# EasyEDA Pro project Drone.eprj, board PCB1
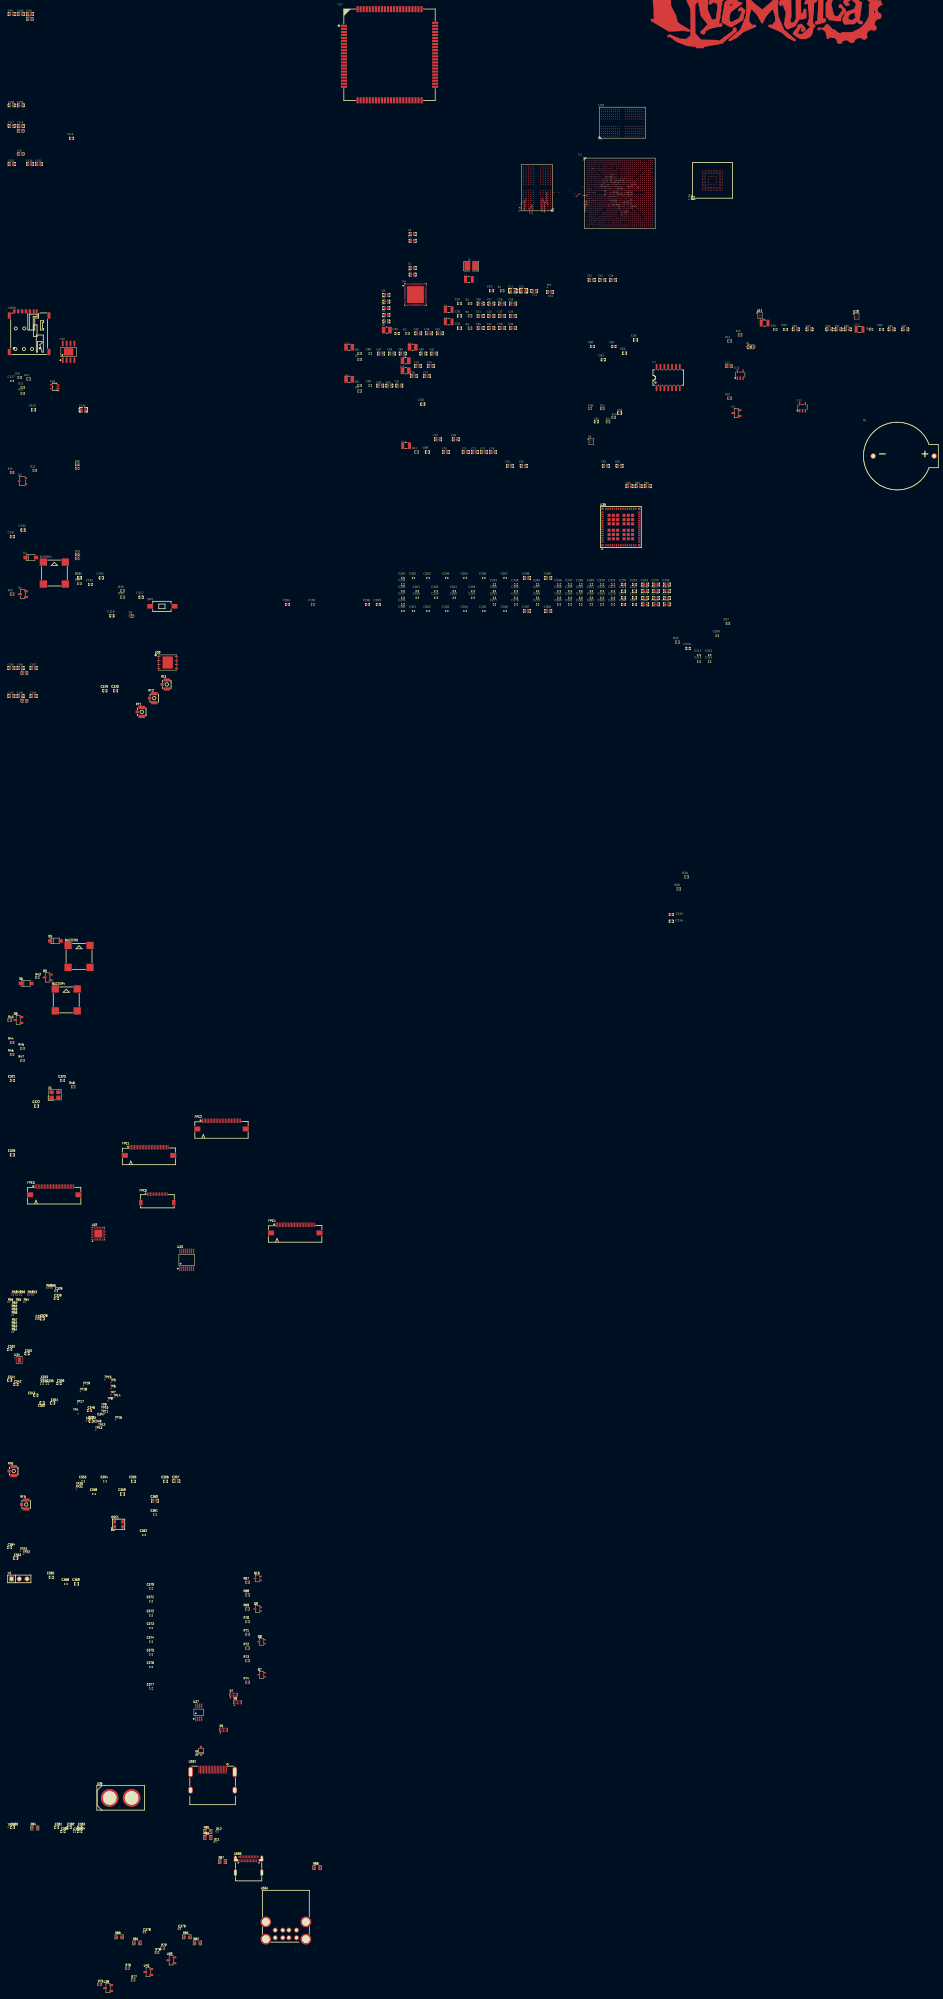
[diagram p9: board, top side]
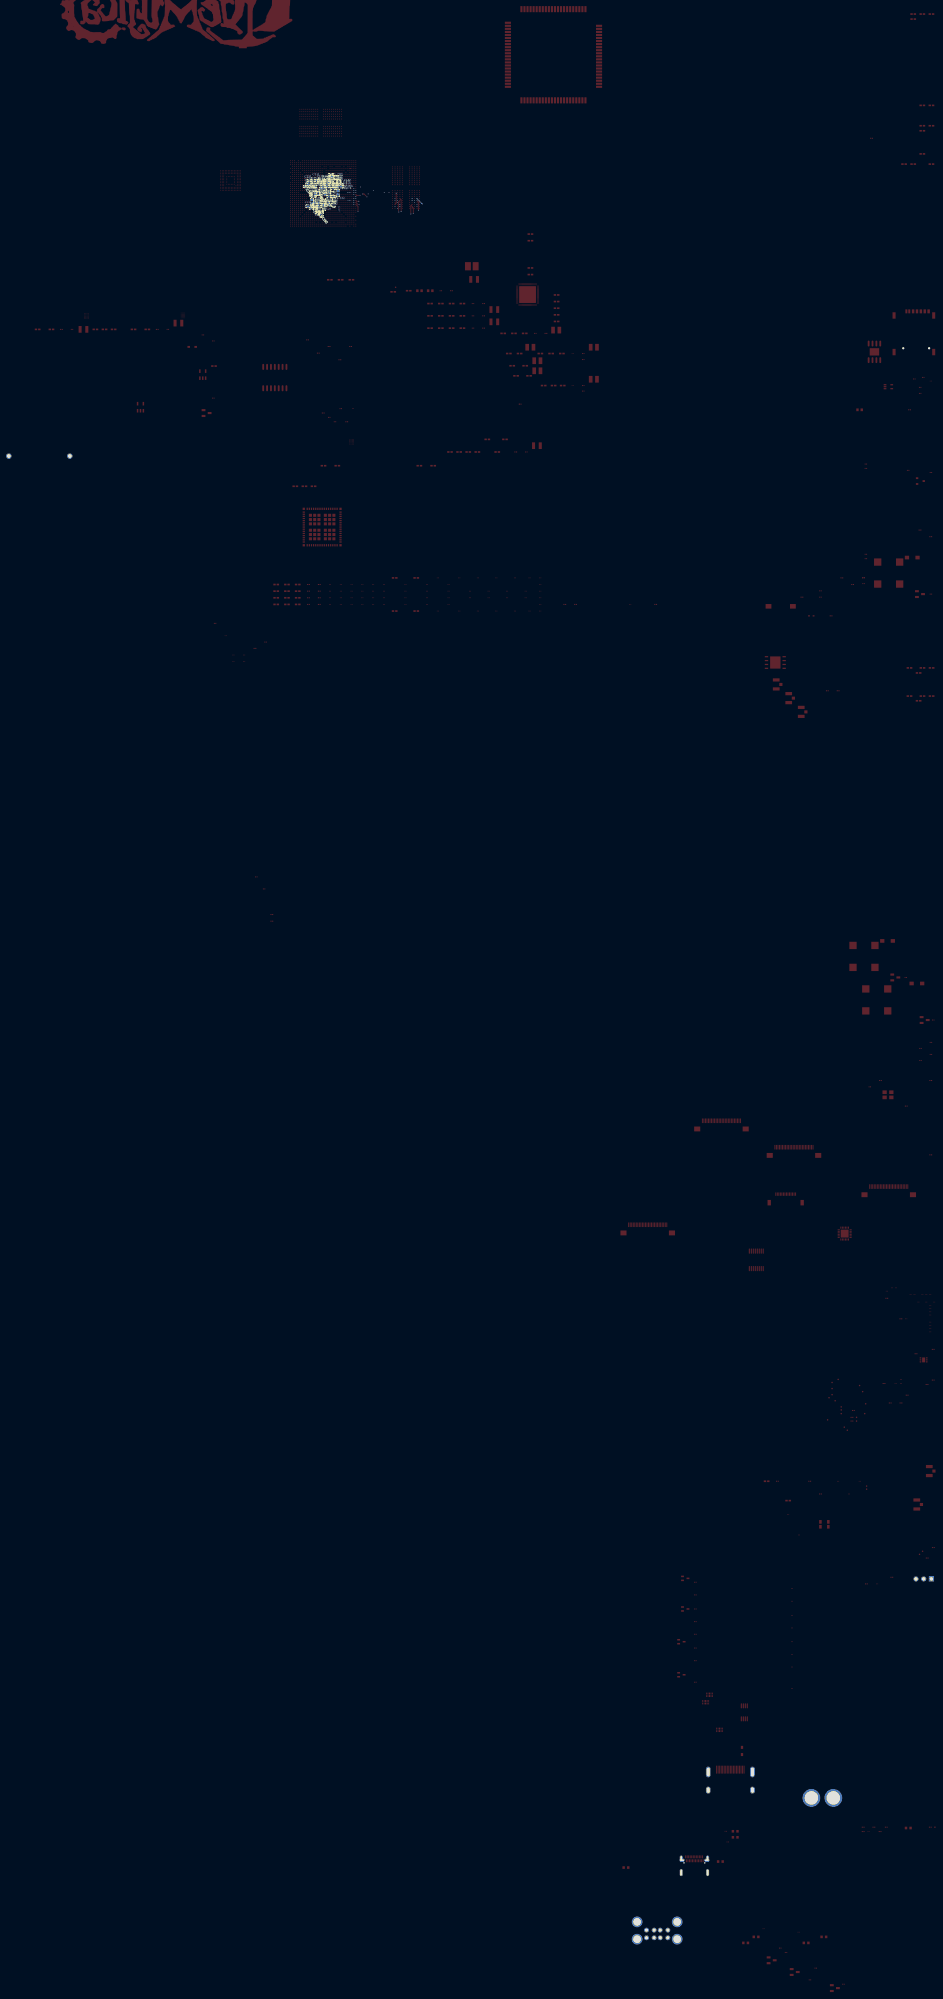
[diagram p10: board, bottom side, seen from below]

Outline 81.01 x 497.2 mm; copper layers: Top Layer, GND1, Inner2, VCC1, VCC2, Inner5, GND2, Bottom Layer. Coordinates in mm from the lower left corner of the outline.
Stack: Top Layer 0.035mm 外层铜厚1oz / Dielectric1 0.1164mm 2116 RC54% 4.9mil / GND1 0.0152mm 内层铜厚 / Dielectric2 0.3mm 0.3mm H/HOZ No copper / Inner2 0.0152mm 内层铜厚 / Dielectric3 0.0764mm 1080 RC67% 3.3mil / Dielectric4 0.0764mm 1080 RC67% 3.3mil / VCC1 0.0152mm 内层铜厚 / Dielectric5 0.3mm 0.3mm H/HOZ No copper / VCC2 0.0152mm 内层铜厚 / Dielectric6 0.0764mm 1080 RC67% 3.3mil / Dielectric7 0.0764mm 1080 RC67% 3.3mil / Inner5 0.0152mm 内层铜厚 / Dielectric8 0.3mm 0.3mm H/HOZ No copper / GND2 0.0152mm 内层铜厚 / Dielectric9 0.1164mm 2116 RC54% 4.9mil / Bottom Layer 0.035mm 外层铜厚1oz

## Design rules (mm)
net CH0_DQ0_A: DDR_CH0_BIT1
net CH0_DQ7_A: DDR_CH0_BIT1
net CH0_DQ1_A: DDR_CH0_BIT1
net CH0_DQ6_A: DDR_CH0_BIT1
net CH0_DQS0P_A: DDR_CH0_BIT1, DQS0_A
net CH0_DQS1P_A: DQS1_A
net CH0_DQ2_A: DDR_CH0_BIT1
net CH0_DQS0N_A: DDR_CH0_BIT1, DQS0_A
net CH0_DQ5_A: DDR_CH0_BIT1
net CH0_DQS1N_A: DQS1_A
net CH0_DQ3_A: DDR_CH0_BIT1
net CH0_DQ4_A: DDR_CH0_BIT1
net CH0_DQS0N_B: DQS0_B
net CH0_DQS1N_B: DQS1_B
net CH0_DQS0P_B: DQS0_B
net CH0_DQS1P_B: DQS1_B
net CH1_DQS0P_C: DQS0_C
net CH1_DQS1P_C: DQS1_C
net CH1_DQS0N_C: DQS0_C
net CH1_DQS1N_C: DQS1_C
net CH1_DQS0N_D: DQS0_D
net CH1_DQS1N_D: DQS1_D
net CH1_DQS0P_D: DQS0_D
net CH1_DQS1P_D: DQS1_D
template: 自定义配置
spacing copperThickness1oz (default): track to track 0.089, other pairs 0 to 0.203
spacing copperThickness2oz: track to track 0.203, other pairs 0.152 to 0.3
track width copperThickness1oz (default): min 0.102, default 0.254, max 2.54
track width copperThickness2oz: min 0.102, default 0.254, max 2.54
differential pair differentialPair (default): width min 0.102, default 0.254, max 2.54; gap min 0.152, default 0.152
via viaSize (default): diameter min 0.305, default 0.305, max 10; hole min 0.102, default 0.203, max 6.299

## Placement (name value [footprint] x y rotation side)
B1  BS-02-A1AJ010  [BAT-TH_BS-02-A1AJ010]  292.25 461.48 0 top
BUZZER1  2.7kHz  [BUZ-SMD_4P-L8.5-W8.5-P8.50-BR]  13.64 423.12 0 top
BUZZER3  2.7kHz  [BUZ-SMD_4P-L8.5-W8.5-P8.50-BR]  21.75 297.43 0 top
BUZZER4  2.7kHz  [BUZ-SMD_4P-L8.5-W8.5-P8.50-BR]  17.55 283.17 0 top
C1  10uF  [C0402]  131.17 520.98 0 top
C2  10uF  [C0402]  131.17 523.16 0 top
C3  22uF  [C0402]  131.17 532.08 0 top
C4  22uF  [C0402]  131.17 534.26 0 top
C5  22uF  [C0402]  122.57 505.61 0 top
C6  10uF  [C0402]  122.57 507.78 0 top
C7  22uF  [C0402]  122.57 509.96 0 top
C8  10uF  [C0402]  122.57 512.13 0 top
C9  22uF  [C0402]  122.57 514.31 0 top
C10  1uF  [C0201]  157.06 515.68 0 top
C11  47uF  [C0603]  164.02 515.68 0 top
C12  47uF  [C0603]  167.55 515.68 0 top
C13  22uF  [C0402]  171.08 515.68 0 top
C14  22uF  [C0402]  176.17 515.33 0 top
C15  100nF  [C01005]  199.16 545.3 180 bottom
C16  100nF  [C01005]  199.16 544.67 180 bottom
C17  1uF  [C0201]  195.6 543.78 90 bottom
C18  1uF  [C0201]  195.6 545.55 270 bottom
C19  4.7uF  [C0201]  197.76 544.67 180 bottom
C20  10uF  [C0402]  197.51 543.9 180 bottom
C21  10uF  [C0402]  197.25 545.3 180 bottom
C22  22uF  [C0402]  189.88 519.27 0 top
C23  22uF  [C0402]  193.41 519.27 0 top
C24  22uF  [C0402]  196.95 519.27 0 top
C25  1uF  [C0201]  146.52 511.47 0 top
C26  22uF  [C0402]  153.47 511.47 0 top
C27  22uF  [C0402]  157.01 511.47 0 top
C28  22uF  [C0402]  160.54 511.47 0 top
C29  22uF  [C0402]  164.08 511.47 0 top
C30  1uF  [C0201]  146.52 507.45 0 top
C31  22uF  [C0402]  153.47 507.45 0 top
C32  22uF  [C0402]  157.01 507.45 0 top
C33  22uF  [C0402]  160.54 507.45 0 top
C34  22uF  [C0402]  164.08 507.45 0 top
C35  1uF  [C0201]  146.52 503.42 0 top
C36  22uF  [C0402]  153.47 503.42 0 top
C37  22uF  [C0402]  157.01 503.42 0 top
C38  22uF  [C0402]  160.54 503.42 0 top
C39  22uF  [C0402]  164.08 503.42 0 top
C40  22uF  [C0402]  134.71 495.09 0 top
C41  22uF  [C0402]  138.24 495.09 0 top
C42  1uF  [C0201]  126.07 501.7 0 top
C43  22uF  [C0402]  133.03 501.7 0 top
C44  22uF  [C0402]  136.56 501.7 0 top
C45  10uF  [C0402]  140.1 501.7 0 top
C46  100pF  [C01005]  117.3 495.09 0 top
C47  22uF  [C0402]  120.84 495.09 0 top
C48  22uF  [C0402]  124.37 495.09 0 top
C49  10uF  [C0402]  127.9 495.09 0 top
C50  100pF  [C01005]  117.3 484.59 0 top
C51  10uF  [C0402]  126.82 484.59 0 top
C52  22uF  [C0402]  120.56 484.59 0 top
C53  22uF  [C0402]  123.55 484.59 0 top
C54  22uF  [C0402]  132.88 491.08 0 top
C55  22uF  [C0402]  137.14 491.08 0 top
C56  22uF  [C0402]  131.61 487.78 0 top
C57  22uF  [C0402]  135.87 487.78 0 top
C58  1uF  [C0201]  134.53 478.5 0 top
C59  1uF  [C0201]  204.27 499.57 0 top
C60  1uF  [C0201]  190.13 497.4 0 top
C61  1uF  [C0201]  197.2 497.4 0 top
C62  1uF  [C0201]  200.74 495.22 0 top
C63  1uF  [C0201]  193.67 493.05 0 top
C64  4.7uF  [C0201]  199.12 475.59 0 top
C65  1nF  [C0201]  191.41 472.73 0 top
C66  100nF  [C01005]  189.38 477.03 0 top
C67  22uF  [C0402]  139.5 466.95 0 top
C68  22uF  [C0402]  145.31 466.95 0 top
C69  1uF  [C0201]  135.97 462.82 0 top
C70  22uF  [C0402]  142.04 462.82 0 top
C71  22uF  [C0402]  148.57 462.82 0 top
C72  22uF  [C0402]  151.56 462.82 0 top
C73  22uF  [C0402]  154.55 462.82 0 top
C74  22uF  [C0402]  157.54 462.82 0 top
C83  22uF  [C0402]  194.51 458.31 0 top
C84  22uF  [C0402]  199.04 458.31 0 top
C85  1uF  [C0201]  285.01 503.01 0 top
C86  22uF  [C0402]  288.27 503.01 0 top
C87  22uF  [C0402]  292.8 503.01 0 top
C88  22uF  [C0402]  202.3 451.57 0 top
C89  22uF  [C0402]  205.29 451.57 0 top
C90  22uF  [C0402]  208.28 451.57 0 top
C91  22uF  [C0402]  163.06 458.31 0 top
C92  22uF  [C0402]  167.59 458.31 0 top
C93  1uF  [C0201]  253.56 503.01 0 top
C94  22uF  [C0402]  256.82 503.01 0 top
C95  22uF  [C0402]  261.36 503.01 0 top
C96  22uF  [C0402]  267.88 503.01 0 top
C97  22uF  [C0402]  270.87 503.01 0 top
C98  22uF  [C0402]  273.86 503.01 0 top
C99  22uF  [C0402]  -0.38 606.39 0 top
C100  22uF  [C0402]  2.61 606.39 0 top
C101  22uF  [C0402]  5.6 606.39 0 top
C102  100nF  [C01005]  201.14 545.96 0 bottom
C103  4.7uF  [C0201]  202.39 546.56 180 bottom
C104  10uF  [C0402]  202.38 547.21 180 bottom
C105  10uF  [C0402]  202.39 547.93 180 bottom
C106  1uF  [C0201]  202.09 548.89 270 bottom
C107  100nF  [C01005]  201.1 548.56 0 bottom
C108  22uF  [C0402]  -0.38 576.45 0 top
C109  22uF  [C0402]  2.61 576.45 0 top
C110  100nF  [C01005]  199.81 552.44 0 bottom
C111  100nF  [C01005]  201.12 552.47 180 bottom
C112  1uF  [C0201]  200.41 543.32 180 bottom
C113  1uF  [C0201]  200.45 544.03 180 bottom
C114  4.7uF  [C0201]  19.27 565.67 0 top
C115  10uF  [C0402]  198.88 543.16 90 bottom
C116  10uF  [C0402]  199.16 547.3 180 bottom
C117  22uF  [C0402]  -0.38 569.78 0 top
C118  22uF  [C0402]  2.61 569.78 0 top
C119  100nF  [C01005]  197.24 547.27 180 bottom
C120  100nF  [C01005]  201.95 545.3 180 bottom
C121  1uF  [C0201]  197.21 546.58 180 bottom
C122  1uF  [C0201]  195.94 546.59 0 bottom
C123  10uF  [C0402]  197.78 548.01 180 bottom
C124  1uF  [C0201]  196.23 547.6 270 bottom
C125  22uF  [C0402]  -0.38 557.2 0 top
C126  22uF  [C0402]  5.6 557.2 0 top
C127  100nF  [C01005]  201.79 543.35 0 bottom
C128  10uF  [C0402]  202.76 544.88 270 bottom
C129  1uF  [C0201]  201.82 544.03 0 bottom
C130  22uF  [C0402]  203.63 543.35 180 bottom
C131  10uF  [C0402]  201.18 544.71 0 bottom
C132  22uF  [C0402]  8.59 557.2 0 top
C133  1uF  [C0201]  203.06 542.72 180 bottom
C134  100nF  [C01005]  201.78 542.7 0 bottom
C135  1uF  [C0201]  6.79 476.64 0 top
C136  47uF  [C0603]  23.18 476.64 0 top
C137  100nF  [C01005]  -0.16 486.06 0 top
C141  1uF  [C0201]  -0.16 435.04 0 top
C142  1uF  [C0201]  3.37 437.22 0 top
C143  1uF  [C0201]  201.43 551.51 270 bottom
C144  100nF  [C01005]  201.81 550.49 180 bottom
C145  22uF  [C0402]  -0.43 392.02 0 top
C146  22uF  [C0402]  2.56 392.02 0 top
C147  22uF  [C0402]  6.82 392.02 0 top
C148  100nF  [C01005]  202.42 552.46 0 bottom
C149  100nF  [C01005]  202.53 551.2 0 bottom
C150  1uF  [C0201]  203.72 551.17 180 bottom
C151  1uF  [C0201]  203.74 551.79 180 bottom
C152  4.7uF  [C0201]  202.43 551.79 0 bottom
C153  10uF  [C0402]  202.56 549.85 0 bottom
C154  10uF  [C0402]  203.69 550.52 180 bottom
C155  1uF  [C0201]  200.44 551.17 180 bottom
C156  100nF  [C01005]  200.44 550.52 180 bottom
C157  22uF  [C0402]  -0.43 382.79 0 top
C158  22uF  [C0402]  2.56 382.79 0 top
C159  22uF  [C0402]  6.82 382.79 0 top
C160  100nF  [C01005]  199.14 550.49 180 bottom
C162  1uF  [C0201]  199.15 549.85 180 bottom
C163  1uF  [C0201]  197.9 549.86 0 bottom
C164  4.7uF  [C0201]  197.86 550.52 0 bottom
C165  10uF  [C0402]  199.14 549.18 180 bottom
C166  10uF  [C0402]  198 551.19 0 bottom
C167  1uF  [C0201]  196.58 553.8 0 bottom
C168  1uF  [C0201]  193.32 550.52 0 bottom
C169  100nF  [C01005]  197.78 552.78 270 bottom
C170  100nF  [C01005]  194.69 549.23 180 bottom
C171  100nF  [C01005]  194.08 552.04 0 bottom
C172  1uF  [C0201]  193.98 551.02 0 bottom
C173  1uF  [C0201]  193.98 551.56 0 bottom
C174  10uF  [C0402]  193.74 549.87 0 bottom
C175  100nF  [C01005]  197.34 552.79 270 bottom
C176  100nF  [C01005]  196.92 552.79 270 bottom
C177  100nF  [C01005]  195.6 552.82 270 bottom
C178  1uF  [C0201]  194.98 552.81 270 bottom
C179  1uF  [C0201]  196.44 551.14 180 bottom
C180  10uF  [C0402]  194.29 547.8 90 bottom
C181  100nF  [C01005]  196.58 549.87 180 bottom
C182  100nF  [C01005]  196.53 550.51 180 bottom
C183  1uF  [C0201]  195.94 549.24 180 bottom
C184  4.7uF  [C0201]  195.26 549.84 0 bottom
C185  10uF  [C0402]  196.3 552.47 90 bottom
C186  100nF  [C01005]  198.76 552.62 270 bottom
C187  100nF  [C01005]  193.85 552.45 0 bottom
C188  1uF  [C0201]  194.48 552.8 270 bottom
C189  4.7uF  [C0201]  194.98 551.52 90 bottom
C190  10uF  [C0402]  199.69 551.84 180 bottom
C191  1uF  [C0201]  21.94 421.53 0 top
C192  1uF  [C0201]  29 421.53 0 top
C193  2.2uF  [C0201]  25.47 419.36 0 top
C194  1uF  [C0201]  90.07 412.84 0 top
C195  100nF  [C01005]  98.41 412.84 0 top
C196  1uF  [C0201]  197.87 551.84 180 bottom
C197  1uF  [C0201]  195.28 550.52 0 bottom
C198  1uF  [C0201]  116.35 412.84 0 top
C199  1uF  [C0201]  119.89 412.84 0 top
C200  100nF  [C01005]  127.92 417.19 0 top
C201  100nF  [C01005]  132.72 417.19 0 top
C202  100nF  [C01005]  138.8 417.19 0 top
C203  100nF  [C01005]  144.87 417.19 0 top
C204  100nF  [C01005]  150.95 417.19 0 top
C205  100nF  [C01005]  158.01 417.19 0 top
C206  100nF  [C01005]  165.08 417.19 0 top
C207  100nF  [C01005]  172.15 417.19 0 top
C208  100nF  [C01005]  179.22 417.19 0 top
C209  100nF  [C01005]  182.75 417.19 0 top
C210  100nF  [C01005]  186.29 417.19 0 top
C211  100nF  [C01005]  189.82 417.19 0 top
C212  100nF  [C01005]  193.35 417.19 0 top
C213  100nF  [C01005]  196.89 417.19 0 top
C214  1uF  [C0201]  200.42 417.19 0 top
C215  1uF  [C0201]  203.96 417.19 0 top
C216  10uF  [C0402]  207.49 417.19 0 top
C217  10uF  [C0402]  211.02 417.19 0 top
C218  22uF  [C0402]  214.56 417.19 0 top
C238  100nF  [C01005]  127.92 419.36 0 top
C243  100nF  [C01005]  158.01 419.36 0 top
C244  100nF  [C01005]  165.08 419.36 0 top
C245  100nF  [C01005]  172.15 419.36 0 top
C246  100nF  [C01005]  179.22 419.36 0 top
C247  100nF  [C01005]  182.75 419.36 0 top
C248  100nF  [C01005]  186.29 419.36 0 top
C249  100nF  [C01005]  189.82 419.36 0 top
C250  100nF  [C01005]  193.35 419.36 0 top
C251  100nF  [C01005]  196.89 419.36 0 top
C252  1uF  [C0201]  200.42 419.36 0 top
C253  1uF  [C0201]  203.96 419.36 0 top
C254  10uF  [C0402]  207.49 419.36 0 top
C255  10uF  [C0402]  211.02 419.36 0 top
C256  22uF  [C0402]  214.56 419.36 0 top
C257  100nF  [C01005]  127.92 415.01 0 top
C258  100nF  [C01005]  132.72 415.01 0 top
C259  100nF  [C01005]  138.8 415.01 0 top
C260  100nF  [C01005]  144.87 415.01 0 top
C261  100nF  [C01005]  150.95 415.01 0 top
C262  100nF  [C01005]  158.01 415.01 0 top
C263  100nF  [C01005]  165.08 415.01 0 top
C264  100nF  [C01005]  172.15 415.01 0 top
C265  100nF  [C01005]  179.22 415.01 0 top
C266  100nF  [C01005]  182.75 415.01 0 top
C267  100nF  [C01005]  186.29 415.01 0 top
C268  100nF  [C01005]  189.82 415.01 0 top
C269  100nF  [C01005]  193.35 415.01 0 top
C270  100nF  [C01005]  196.89 415.01 0 top
C271  1uF  [C0201]  200.42 415.01 0 top
C272  1uF  [C0201]  203.96 415.01 0 top
C273  10uF  [C0402]  207.49 415.01 0 top
C274  10uF  [C0402]  211.02 415.01 0 top
C275  22uF  [C0402]  214.56 415.01 0 top
C276  100nF  [C01005]  127.92 412.84 0 top
C277  100nF  [C01005]  158.01 412.84 0 top
C278  100nF  [C01005]  165.08 412.84 0 top
C279  100nF  [C01005]  172.15 412.84 0 top
C280  100nF  [C01005]  179.22 412.84 0 top
C281  100nF  [C01005]  182.75 412.84 0 top
C282  100nF  [C01005]  186.29 412.84 0 top
C283  100nF  [C01005]  189.82 412.84 0 top
C284  100nF  [C01005]  193.35 412.84 0 top
C285  100nF  [C01005]  196.89 412.84 0 top
C286  1uF  [C0201]  200.42 412.84 0 top
C287  1uF  [C0201]  203.96 412.84 0 top
C288  10uF  [C0402]  207.49 412.84 0 top
C289  10uF  [C0402]  211.02 412.84 0 top
C290  22uF  [C0402]  214.56 412.84 0 top
C291  100nF  [C01005]  127.92 421.53 0 top
C292  100nF  [C01005]  131.45 421.53 0 top
C293  100nF  [C01005]  136.26 421.53 0 top
C294  100nF  [C01005]  142.33 421.53 0 top
C295  100nF  [C01005]  148.41 421.53 0 top
C296  100nF  [C01005]  154.48 421.53 0 top
C297  100nF  [C01005]  161.55 421.53 0 top
C298  10uF  [C0402]  168.62 421.53 0 top
C299  10uF  [C0402]  175.68 421.53 0 top
C300  100nF  [C01005]  127.92 410.66 0 top
C301  100nF  [C01005]  131.45 410.66 0 top
C302  100nF  [C01005]  136.26 410.66 0 top
C303  100nF  [C01005]  142.33 410.66 0 top
C304  100nF  [C01005]  148.41 410.66 0 top
C305  100nF  [C01005]  154.48 410.66 0 top
C306  100nF  [C01005]  161.55 410.66 0 top
C307  10uF  [C0402]  168.62 410.66 0 top
C308  10uF  [C0402]  175.68 410.66 0 top
C309  100nF  [C01005]  231.12 402.57 0 top
C310  10pF  [C0201]  221.51 398.42 0 top
C311  100nF  [C01005]  225.05 396.25 0 top
C312  100nF  [C01005]  228.58 396.25 0 top
C313  4.7uF  [C0201]  215.98 311.16 0 top
C314  100nF  [C01005]  225.05 394.07 0 top
C315  100nF  [C01005]  228.58 394.07 0 top
C316  4.7uF  [C0201]  215.98 308.98 0 top
C317  10nF  [C0201]  42.09 415.21 0 top
C318  1nF  [C0201]  32.54 409.08 0 top
C319  100nF  [C0201]  30.23 384.52 0 top
C320  1uF  [C0201]  33.76 384.52 0 top
C321  100nF  [C0201]  -0.16 256.74 0 top
C322  18pF  [C0201]  7.87 248.35 0 top
C323  18pF  [C0201]  16.34 256.74 0 top
C326  1uF  [C0201]  -0.16 232.37 0 top
C327  100nF  [C01005]  7.87 178.61 0 top
C328  1uF  [C0201]  9.63 178.61 0 top
C329  100nF  [C01005]  14.26 187.68 0 top
C330  1uF  [C0201]  14.26 185.34 0 top
C331  1uF  [C0201]  4.67 167.16 0 top
C332  1uF  [C0201]  -0.97 168.59 0 top
C333  100nF  [C01005]  9.61 158.68 0 top
C334  100nF  [C01005]  9.61 157.4 0 top
C335  100nF  [C01005]  11.38 157.4 0 top
C336  1uF  [C0201]  15.17 157.4 0 top
C337  100nF  [C01005]  200.28 546.72 52.5 bottom
C338  1uF  [C0201]  200.78 547.59 270 bottom
C339  100nF  [C01005]  204.84 549.29 48.8 bottom
C340  1uF  [C0201]  205.03 549.88 0 bottom
C341  2.2nF  [C0201]  -0.97 158.52 0 top
C342  2.2nF  [C0201]  1.06 157.09 0 top
C343  1uF  [C0201]  7.59 153.57 0 top
C344  1uF  [C0201]  199.72 541.45 0 bottom
C345  100nF  [C01005]  201.28 542 222.6 bottom
C346  2.2uF  [C0201]  25.21 148.57 0 top
C347  2.2uF  [C0201]  25.69 146.31 0 top
C348  1uF  [C0201]  25.69 145.09 0 top
C349  100nF  [C01005]  201.13 540.75 180 bottom
C350  1uF  [C0201]  199.83 540.48 49.5 bottom
C351  1uF  [C0201]  13.14 151.02 0 top
C352  1uF  [C0201]  9.61 151.02 0 top
C353  100nF  [C01005]  23.15 125.36 0 top
C354  100nF  [C01005]  30.21 125.36 0 top
C355  1uF  [C0201]  39.54 125.36 0 top
C356  1uF  [C0201]  50.14 125.36 0 top
C357  10uF  [C0402]  53.68 125.36 0 top
C358  100nF  [C01005]  26.68 121.18 0 top
C359  1uF  [C0201]  36.01 121.18 0 top
C360  10uF  [C0402]  46.61 119.01 0 top
C361  100nF  [C01005]  46.61 114.4 0 top
C362  15pF  [C01005]  43.08 107.74 0 top
C363  1pF  [C0201]  1.01 100.18 0 top
C364  1pF  [C0201]  -1.02 103.61 0 top
C365  1uF  [C0201]  12.61 93.88 0 top
C366  100nF  [C01005]  201.84 541.72 180 bottom
C367  1uF  [C0201]  201.11 541.34 180 bottom
C368  100nF  [C01005]  17.41 91.7 0 top
C369  1uF  [C0201]  20.95 91.7 0 top
C370  220nF  [C01005]  45.34 90.17 0 top
C371  220nF  [C01005]  45.34 86.02 0 top
C372  220nF  [C01005]  45.34 81.41 0 top
C373  220nF  [C01005]  45.34 77.26 0 top
C374  220nF  [C01005]  45.34 72.74 0 top
C375  220nF  [C01005]  45.34 68.6 0 top
C376  220nF  [C01005]  45.34 64.45 0 top
C377  220nF  [C01005]  45.34 57.4 0 top
C378  100nF  [C01005]  43.19 -22.48 0 top
C379  100nF  [C01005]  54.68 -21.36 0 top
C380  2.2uF  [C0201]  -0.02 11.94 0 top
C381  4.7uF  [C0201]  14.43 11.94 0 top
C382  4.7uF  [C0201]  18.48 11.94 0 top
C383  1uF  [C0201]  22.01 11.94 0 top
C384  1uF  [C0201]  22.01 10.5 0 top
C385  100nF  [C01005]  20.25 10.5 0 top
C386  4.7uF  [C0201]  16.46 10.5 0 top
CARD1  SMN-303  [SIM-SMD_SMN-303]  5.37 502.25 0 top
D1  BZT52C3V0S  [SOD-323_L1.7-W1.3-LS2.6-RD]  242.1 497.27 0 top
D2  1N4007W  [SOD-123FL_L2.7-W1.8-LS3.8-RD]  5.91 428.2 0 top
D3  H5VUD5BB  [SOD-523_L1.2-W0.8-LS1.6-BI]  39.03 409.08 0 top
D5  1N4007W  [SOD-123FL_L2.7-W1.8-LS3.8-RD]  14.01 302.51 0 top
D6  1N4007W  [SOD-123FL_L2.7-W1.8-LS3.8-RD]  4.38 288.56 0 top
D7  ESD224DQAR  [USON-10_L2.5-W1.0-P0.50-BL]  72.41 55.34 0 top
D8  ESD224DQAR  [USON-10_L2.5-W1.0-P0.50-BL]  73.68 52.9 0 top
D9  ESD224DQAR  [USON-10_L2.5-W1.0-P0.50-BL]  69.11 43.85 0 top
D10  B5819WS-TP  [SOD-323_L1.8-W1.3-LS2.5-RD]  61.76 36.93 90 top
D11  ESD441DPLR  [X2SON-2_L0.6-W0.3-P0.35]  66.44 7.1 0 top
D12  ESD441DPLR  [X2SON-2_L0.6-W0.3-P0.35]  67.09 10.57 0 top
FPC1  AFC01-S26FCC-00  [FPC-SMD_AFC01-S26FCC-00]  44.71 233.53 0 top
FPC2  AFC01-S26FCC-00  [FPC-SMD_AFC01-S26FCC-00]  68.5 242.2 0 top
FPC3  AFC01-S26FCC-00  [FPC-SMD_AFC01-S26FCC-00]  13.62 220.63 0 top
FPC4  AFC01-S26FCC-00  [FPC-SMD_AFC01-S26FCC-00]  92.68 208.11 0 top
FPC5  FPC-05F-14PH15  [FPC-SMD_14P-P0.50_XUNPU_FPC-05F-14PH15]  47.42 218.09 0 top
H1  PZ254V-11-03P  [HDR-TH_3P-P2.54-V-M]  2.16 93.34 0 top
L1  220nH  [IND-SMD_L3.2-W2.5_SRP3212]  150.39 523.71 0 top
L2  240nH  [IND-SMD_L2.5-W2.0_MHCHL2520]  149.63 519.39 0 top
L3  240nH  [IND-SMD_L2.5-W2.0_MHCHL2520]  143 509.51 0 top
L4  240nH  [IND-SMD_L2.5-W2.0_MHCHL2520]  143 505.48 0 top
L5  470nH  [IND-SMD_L2.5-W2.0]  131.19 497.16 0 top
L6  470nH  [IND-SMD_L2.5-W2.0]  122.7 502.77 0 top
L7  470nH  [IND-SMD_L2.5-W2.0]  110.36 497.16 0 top
L8  470nH  [IND-SMD_L2.5-W2.0]  110.36 486.66 0 top
L9  470nH  [IND-SMD_L2.5-W2.0]  128.89 492.73 0 top
L10  470nH  [IND-SMD_L2.5-W2.0]  128.89 489.43 0 top
L11  240nH  [IND-SMD_L2.5-W2.0_MHCHL2520]  129.03 464.88 0 top
L13  240nH  [IND-SMD_L2.5-W2.0_MHCHL2520]  277.77 503.01 0 top
L14  240nH  [IND-SMD_L2.5-W2.0_MHCHL2520]  246.62 505.07 0 top
L15  BLM15PD121SN1D  [L0402]  234.95 490.98 0 top
L16  BLM15PD121SN1D  [L0402]  5.6 604.74 0 top
L17  BLM15PD121SN1D  [L0402]  2.61 568.13 0 top
L18  BLM15PD121SN1D  [L0402]  2.61 560.54 0 top
L19  BLM15PD121SN1D  [L0402]  3.83 390.37 0 top
L20  BLM15PD121SN1D  [L0402]  3.83 381.24 0 top
OSC1  32.768kHz  [OSC-SMD_4P-L3.2-W2.5-BL_TG-5006CE]  34.74 111.24 0 top
Q1  AO3400  [SOT-23-3_L2.9-W1.3-P1.90-LS2.4-BR]  237.39 475.58 0 top
Q2  MMBT5551-E  [SOT-23-3_L2.9-W1.8-P1.90-LS2.4-BR]  3.23 453.28 0 top
Q3  SS8050  [SOT-23-3_L2.9-W1.3-P1.90-LS2.4-BR]  3.37 416.22 0 top
Q5  SS8050  [SOT-23-3_L2.9-W1.3-P1.90-LS2.4-BR]  11.47 290.53 0 top
Q6  SS8050  [SOT-23-3_L2.9-W1.3-P1.90-LS2.4-BR]  1.84 276.57 0 top
Q7  WNM6002-3/TR  [SOT-323-3_L2.0-W1.3-P1.30-LS2.1-BR]  81.64 61.91 0 top
Q8  WNM6002-3/TR  [SOT-323-3_L2.0-W1.3-P1.30-LS2.1-BR]  81.64 72.74 0 top
Q9  WNM6002-3/TR  [SOT-323-3_L2.0-W1.3-P1.30-LS2.1-BR]  80.37 83.48 0 top
Q10  WNM6002-3/TR  [SOT-323-3_L2.0-W1.3-P1.30-LS2.1-BR]  80.37 93.51 0 top
R1  100Ω  [R0201]  160.54 515.68 0 top
R2  100Ω  [R0201]  150 511.47 0 top
R3  100Ω  [R0201]  150 507.45 0 top
R4  100Ω  [R0201]  150 503.42 0 top
R5  100Ω  [R0201]  129.55 501.7 0 top
R6  120kΩ  [R0201]  113.82 495.09 0 top
R7  100kΩ  [R0201]  113.82 493.12 0 top
R8  20kΩ  [R0201]  113.82 484.59 0 top
R9  100kΩ  [R0201]  113.82 482.78 0 top
R10  200kΩ  [R0201]  197.16 474.16 0 top
R11  200kΩ  [R0201]  195.26 472.73 0 top
R12  200kΩ  [R0201]  193.37 477.03 0 top
R13  100Ω  [R0201]  132.49 462.82 0 top
R14  120kΩ  [R0201]  235.16 499.22 0 top
R15  100kΩ  [R0201]  238.59 501.19 0 top
R17  100Ω  [R0201]  281.53 503.01 0 top
R18  100Ω  [R0201]  250.08 503.01 0 top
R19  100kΩ  [R0201]  235.16 480.47 0 top
R20  30.1kΩ  [R0201]  2.31 487.26 0 top
R21  200kΩ  [R0201]  5.23 486.75 0 top
R22  22Ω  [R0201]  3.32 483.99 0 top
R23  22Ω  [R0201]  3.32 482.02 0 top
R24  10kΩ  [R0201]  -0.22 456.09 0 top
R25  10kΩ  [R0201]  7.26 456.78 0 top
R28  470Ω  [R0201]  -0.22 416.22 0 top
R29  240Ω  [R0201]  21.12 458.86 0 top
R30  240Ω  [R0201]  21.12 457.42 0 top
R31  240Ω  [R0201]  21.12 429.27 0 top
R32  240Ω  [R0201]  21.12 427.84 0 top
R33  22Ω  [R0201]  21.88 421.63 0 top
R34  22Ω  [R0201]  21.88 419.66 0 top
R35  47kΩ  [R0201]  218.04 400.49 0 top
R36  10kΩ  [R0201]  218.52 319.55 0 top
R37  10kΩ  [R0201]  234.6 406.62 0 top
R38  10kΩ  [R0201]  221.06 323.5 0 top
R39  10kΩ  [R0201]  36.02 417.29 0 top
R40  10kΩ  [R0201]  36.02 415.21 0 top
R42  470Ω  [R0201]  8.01 290.53 0 top
R43  470Ω  [R0201]  -0.98 276.57 0 top
R44  100kΩ  [R0201]  -0.22 269.23 0 top
R45  120kΩ  [R0201]  3.2 267.26 0 top
R46  100kΩ  [R0201]  -0.22 265.29 0 top
R47  120kΩ  [R0201]  3.2 263.31 0 top
R48  22Ω  [R0201]  19.82 254.67 0 top
R49  10kΩ  [R01005]  1.27 186.59 0 top
R50  10kΩ  [R01005]  2.57 186.59 0 top
R51  10kΩ  [R01005]  5.17 186.59 0 top
R52  10kΩ  [R01005]  -0.03 186.59 0 top
R53  10kΩ  [R01005]  6.47 186.59 0 top
R54  10kΩ  [R01005]  3.87 184.1 0 top
R55  10kΩ  [R01005]  1.27 184.1 0 top
R56  10kΩ  [R01005]  -1.33 184.1 0 top
R57  10kΩ  [R01005]  -0.03 177.52 0 top
R58  10kΩ  [R01005]  -0.03 179.86 0 top
R59  10kΩ  [R01005]  -0.03 180.92 0 top
R60  10kΩ  [R01005]  -0.03 181.98 0 top
R61  10kΩ  [R01005]  -0.03 183.04 0 top
R62  10kΩ  [R01005]  -0.03 176.46 0 top
R63  10kΩ  [R01005]  -0.03 175.4 0 top
R64  10kΩ  [R01005]  -0.03 174.34 0 top
R65  1.8kΩ  [R01005]  11.3 188.77 0 top
R66  1.8kΩ  [R01005]  12.6 188.77 0 top
R67  590Ω  [R0201]  77.04 92.24 0 top
R68  590Ω  [R0201]  77.04 88.09 0 top
R69  590Ω  [R0201]  77.04 83.48 0 top
R70  590Ω  [R0201]  77.04 79.33 0 top
R71  590Ω  [R0201]  77.04 75.18 0 top
R72  590Ω  [R0201]  77.04 70.67 0 top
R73  590Ω  [R0201]  77.04 66.52 0 top
R74  590Ω  [R0201]  77.04 59.47 0 top
R75  27kΩ  [R0201]  28.47 -39.55 0 top
R76  1.2kΩ  [R0201]  37.57 -34.28 0 top
R77  47kΩ  [R0201]  39.46 -38.11 0 top
R78  47kΩ  [R0201]  47.31 -29.14 0 top
R79  47kΩ  [R0201]  49.21 -27.7 0 top
R80  10K  [R0603]  34.91 -24.03 0 top
R81  10K  [R0603]  40.73 -26 0 top
R82  10K  [R0603]  60.56 -26 0 top
R83  10K  [R0603]  57.14 -24.03 0 top
R84  8.2K  [R0603]  7.21 11.67 0 top
R85  2.2  [R0603]  63.99 10.6 0 top
R86  2.2  [R0603]  63.99 8.62 0 top
R87  5.1K  [R0603]  68.84 0.67 0 top
R88  5.1K  [R0603]  99.82 -1.3 0 top
RF1  BWIPX-1-001E  [IPEX-SMD_BWIPX-1-001E]  41.56 377.61 0 top
RF2  BWIPX-1-001E  [IPEX-SMD_BWIPX-1-001E]  45.67 382.11 0 top
RF3  BWIPX-1-001E  [IPEX-SMD_BWIPX-1-001E]  49.77 386.61 0 top
RF5  BWIPX-1-001E  [IPEX-SMD_BWIPX-1-001E]  3.66 117.74 0 top
RF6  BWIPX-1-001E  [IPEX-SMD_BWIPX-1-001E]  -0.44 128.69 0 top
SW1  TS-1101-C-W  [SW-SMD_L6.0-W3.3-LS8.0]  49.06 412.22 0 top
TP1  -  [Test-Point-0.5mm]  175.38 516.81 0 top
TP2  -  [Test-Point-0.5mm]  24.18 145.09 0 top
TP3  -  [Test-Point-0.5mm]  24.18 146.31 0 top
TP4  -  [Test-Point-0.5mm]  21.5 147.52 0 top
TP5  -  [Test-Point-0.5mm]  32.21 157.74 0 top
TP6  -  [Test-Point-0.5mm]  32.21 155.74 0 top
TP7  -  [Test-Point-0.5mm]  32.21 153.74 0 top
TP8  -  [Test-Point-0.5mm]  31.21 151.74 0 top
TP9  -  [Test-Point-0.5mm]  29.21 149.74 0 top
TP10  -  [Test-Point-0.5mm]  29.21 148.74 0 top
TP11  -  [Test-Point-0.5mm]  29.21 147.52 0 top
TP12  -  [Test-Point-0.5mm]  28.21 143.09 0 top
TP13  -  [Test-Point-0.5mm]  27.21 142.09 0 top
TP14  -  [Test-Point-0.5mm]  33.21 152.74 0 top
TP15  -  [Test-Point-0.5mm]  30.21 158.74 0 top
TP16  -  [Test-Point-0.5mm]  33.67 145.49 0 top
TP17  -  [Test-Point-0.5mm]  21.18 150.74 0 top
TP18  -  [Test-Point-0.5mm]  22.18 154.74 0 top
TP19  -  [Test-Point-0.5mm]  23.18 156.74 0 top
TP20  -  [Test-Point-0.5mm]  20.88 123.77 0 top
TP21  -  [Test-Point-0.5mm]  20.88 122.77 0 top
TP22  -  [Test-Point-0.5mm]  3.52 101.4 0 top
TP23  -  [Test-Point-0.5mm]  2.52 102.4 0 top
TP24  -  [Test-Point-0.5mm]  -1.53 11.94 0 top
U1  RK3588  [FCBGA-1088_L23.0-W23.0-P0.65-TL_RK3588]  199.16 547.59 0 top
U6  RK806-1  [QFN-68_L7.0-W7.0-P0.35-BL-EP5.5]  132.1 514.43 0 top
U7  RX8025T-UC  [SOIC-14_L10.1-W5.0-P1.27-LS7.4-BL]  215 487.21 0 top
U8  RK860-3  [WLCSP-20_L2.0-W1.6-R5-C4-P0.40-TL]  189.81 466.2 0 top
U10  RK860-2  [WLCSP-20_L2.0-W1.6-R5-C4-P0.40-TL]  276.8 507.35 0 top
U11  RK860-0  [WLCSP-20_L2.0-W1.6-R5-C4-P0.40-TL]  245.13 507.58 0 top
U12  LP5907MFX-3.0/NOPB  [SOT-23-5_L3.0-W1.7-P0.95-LS2.8-BL]  238.64 488.17 0 top
U13  LP5907MFX-3.0/NOPB  [SOT-23-5_L3.0-W1.7-P0.95-LS2.8-BL]  259.07 477.49 0 top
U14  K4UCE3Q4AB-MGCL  [FBGA-200_L15.0-W10.0-BL_RS512M32LO4D1BDS-53BT]  171.97 549.46 90 top
U16  KLMBG2JETD-B041  [FBGA-153_L13.0-W11.5-P0.50_KLMAG1JETD-B041]  229.5 551.85 90 top
U17  SIM7600E  [COMM-SMD_L30.0-W30.0_SIM7600E]  123.59 593.05 0 top
U19  TPS7A7002DDAR  [SOIC-8_L4.9-W3.9-P1.27-LS6.0-BL-EP]  18.31 495.64 0 top
U26  ESDA6V1W5  [SC-70-5_L2.1-W1.3-P0.65-LS2.1-BR]  13.74 484.21 0 top
U29  K4UCE3Q4AB-MGCL  [FBGA-200_L15.0-W10.0-BL_RS512M32LO4D1BDS-53BT]  199.96 570.79 0 top
U30  W25Q256JWPIQ  [WSON-8_L6.0-W5.0-P1.27-TL-EP]  50.83 393.79 0 top
U32  TCA9548ARGER  [VQFN-24_L4.0-W4.0-P0.50-BL-EP2.5]  28.08 206.56 0 top
U33  PCA9557PW,118  [TSSOP-16_L5.0-W4.4-P0.65-LS6.4-BL]  57.07 197.95 0 top
U34  LP5912-1.8DRVR  [WSON-6_L2.0-W2.0-P0.65-TL-EP]  2.18 165.14 0 top
U35  2.4GHz  [WIRELM-SMD_TI_WL18X]  199.48 438.2 0 top
U36  XT60-M.  [CONN-TH_XT60]  35.39 21.53 0 top
U37  TCA9517DGKR  [VSSOP-8_L3.0-W3.0-P0.65-LS5.0-BL]  61 49.59 0 top
U38  2SK3018  [SOT-23-3_L2.9-W1.3-P0.95-LS2.4-BR]  31.3 -40.82 0 top
U39  2SK3018  [SOT-23-3_L2.9-W1.3-P0.95-LS2.4-BR]  52.03 -31.71 0 top
U40  2SK3018  [SOT-23-3_L2.9-W1.3-P0.95-LS2.4-BR]  44.46 -35.55 0 top
USB1  HDMI-001S  [HDMI-SMD_HDMI-001S]  65.58 27.45 0 top
USB3  TYPE-C 24P QT  [USB-C-SMD_TYPE-C-24P-QT]  77.37 -0.37 0 top
USB4  USB-269-BRW  [USB-A-TH_USB-269-BRW]  89.58 -21.94 0 top
X1  24MHz  [CRYSTAL-SMD_4P-L3.2-W2.5-BL]  13.87 252.06 0 top

## Footprints (pads in the part's own frame, mm; a bottom-side part is the same pattern mirrored in y, then rotated)
BAT-TH_BS-02-A1AJ010
  round 1.8 hole 1.2: 1(-10,0) 2(10,0)
BUZ-SMD_4P-L8.5-W8.5-P8.50-BR
  rect 2.4x2.4 smd: 1(-3.6,-3.6) 2(3.6,-3.6) 3(3.599,3.599) 4(-3.6,3.6)
C0201
  rect 0.368x0.324 smd: 1(-0.275,0) 2(0.275,0)
C0402
  rect 0.79x0.54 smd: 1(-0.545,0) 2(0.545,0)
C0603
  rect 0.8x0.9 smd: 1(-0.7,0) 2(0.7,0)
C01005
  rect 0.21x0.22 smd: 1(-0.195,0) 2(0.195,0)
COMM-SMD_L30.0-W30.0_SIM7600E
  rect 2x0.7 smd: 1(-14.95,9.486) 2(-14.95,8.486) 3(-14.95,7.486) 4(-14.95,6.486) 5(-14.95,5.486) 6(-14.95,4.486) 7(-14.95,3.486) 8(-14.95,2.486) 9(-14.95,1.486) 10(-14.95,0.486) 11(-14.95,-0.514) 12(-14.95,-1.514) 13(-14.95,-2.514) 14(-14.95,-3.514) 15(-14.95,-4.514) 16(-14.95,-5.514) 17(-14.95,-6.514) 18(-14.95,-7.514) 19(-14.95,-8.514) 20(-14.95,-9.514) 41(14.95,-9.514) 42(14.95,-8.514) 43(14.95,-7.514) 44(14.95,-6.514) 45(14.95,-5.514) 46(14.95,-4.514) 47(14.95,-3.514) 48(14.95,-2.514) 49(14.95,-1.514) 50(14.95,-0.514) 51(14.95,0.486) 52(14.95,1.486) 53(14.95,2.486) 54(14.95,3.486) 55(14.95,4.486) 56(14.95,5.486) 57(14.95,6.486) 58(14.95,7.486) 59(14.95,8.486) 60(14.95,9.486) 81(-14.95,-10.514) 82(14.95,-10.514) 85(14.95,10.486)
  rect 0.7x2 smd: 21(-9.486,-14.95) 22(-8.486,-14.95) 23(-7.486,-14.95) 24(-6.486,-14.95) 25(-5.486,-14.95) 26(-4.486,-14.95) 27(-3.486,-14.95) 28(-2.486,-14.95) 29(-1.486,-14.95) 30(-0.486,-14.95) 31(0.514,-14.95) 32(1.514,-14.95) 33(2.514,-14.95) 34(3.514,-14.95) 35(4.514,-14.95) 36(5.514,-14.95) 37(6.514,-14.95) 38(7.514,-14.95) 39(8.514,-14.95) 40(9.514,-14.95) 61(9.514,14.95) 62(8.514,14.95) 63(7.514,14.95) 64(6.514,14.95) 65(5.514,14.95) 66(4.514,14.95) 67(3.514,14.95) 68(2.514,14.95) 69(1.514,14.95) 70(0.514,14.95) 71(-0.486,14.95) 72(-1.486,14.95) 73(-2.486,14.95) 74(-3.486,14.95) 75(-4.486,14.95) 76(-5.486,14.95) 77(-6.486,14.95) 78(-7.486,14.95) 79(-8.486,14.95) 80(-9.486,14.95) 83(10.514,-14.95) 84(-10.486,-14.95) 86(-10.486,14.95) 87(10.514,14.95)
CONN-TH_XT60
  round 5.8 hole 4.4: 1(-3.6,0) 2(3.6,0)
CRYSTAL-SMD_4P-L3.2-W2.5-BL
  rect 1.4x1.2 smd: 1(-1.1,-0.85) 2(1.1,-0.85) 3(1.1,0.85) 4(-1.1,0.85)
FBGA-153_L13.0-W11.5-P0.50_KLMAG1JETD-B041
  round 0.25 smd: A1(-3.25,3.25) A2(-2.75,3.25) A3(-2.25,3.25) A4(-1.75,3.25) A5(-1.25,3.25) A6(-0.75,3.25) A7(-0.25,3.25) A8(0.25,3.25) A9(0.75,3.25) A10(1.25,3.25) A11(1.75,3.25) A12(2.25,3.25) A13(2.75,3.25) A14(3.25,3.25) B1(-3.25,2.75) B2(-2.75,2.75) B3(-2.25,2.75) B4(-1.75,2.75) B5(-1.25,2.75) B6(-0.75,2.75) B7(-0.25,2.75) B8(0.25,2.75) B9(0.75,2.75) B10(1.25,2.75) B11(1.75,2.75) B12(2.25,2.75) B13(2.75,2.75) B14(3.25,2.75) C1(-3.25,2.25) C2(-2.75,2.25) C3(-2.25,2.25) C4(-1.75,2.25) C5(-1.25,2.25) C6(-0.75,2.25) C7(-0.25,2.25) C8(0.25,2.25) C9(0.75,2.25) C10(1.25,2.25) C11(1.75,2.25) C12(2.25,2.25) C13(2.75,2.25) C14(3.25,2.25) D1(-3.25,1.75) D2(-2.75,1.75) D3(-2.25,1.75) D4(-1.75,1.75) D12(2.25,1.75) D13(2.75,1.75) D14(3.25,1.75) E1(-3.25,1.25) E2(-2.75,1.25) E3(-2.25,1.25) E5(-1.25,1.25) E6(-0.75,1.25) E7(-0.25,1.25) E8(0.25,1.25) E9(0.75,1.25) E10(1.25,1.25) E12(2.25,1.25) E13(2.75,1.25) E14(3.25,1.25) F1(-3.25,0.75) F2(-2.75,0.75) F3(-2.25,0.75) F5(-1.25,0.75) F10(1.25,0.75) F12(2.25,0.75) F13(2.75,0.75) F14(3.25,0.75) G1(-3.25,0.25) G2(-2.75,0.25) G3(-2.25,0.25) G5(-1.25,0.25) G10(1.25,0.25) G12(2.25,0.25) G13(2.75,0.25) G14(3.25,0.25) H1(-3.25,-0.25) H2(-2.75,-0.25) H3(-2.25,-0.25) H5(-1.25,-0.25) H10(1.25,-0.25) H12(2.25,-0.25) H13(2.75,-0.25) H14(3.25,-0.25) J1(-3.25,-0.75) J2(-2.75,-0.75) J3(-2.25,-0.75) J5(-1.25,-0.75) J10(1.25,-0.75) J12(2.25,-0.75) J13(2.75,-0.75) J14(3.25,-0.75) K1(-3.25,-1.25) K2(-2.75,-1.25) K3(-2.25,-1.25) K5(-1.25,-1.25) K6(-0.75,-1.25) K7(-0.25,-1.25) K8(0.25,-1.25) K9(0.75,-1.25) K10(1.25,-1.25) K12(2.25,-1.25) K13(2.75,-1.25) K14(3.25,-1.25) L1(-3.25,-1.75) L2(-2.75,-1.75) L3(-2.25,-1.75) L12(2.25,-1.75) L13(2.75,-1.75) L14(3.25,-1.75) M1(-3.25,-2.25) M2(-2.75,-2.25) M3(-2.25,-2.25) M4(-1.75,-2.25) M5(-1.25,-2.25) M6(-0.75,-2.25) M7(-0.25,-2.25) M8(0.25,-2.25) M9(0.75,-2.25) M10(1.25,-2.25) M11(1.75,-2.25) M12(2.25,-2.25) M13(2.75,-2.25) M14(3.25,-2.25) N1(-3.25,-2.75) N2(-2.75,-2.75) N3(-2.25,-2.75) N4(-1.75,-2.75) N5(-1.25,-2.75) N6(-0.75,-2.75) N7(-0.25,-2.75) N8(0.25,-2.75) N9(0.75,-2.75) N10(1.25,-2.75) N11(1.75,-2.75) N12(2.25,-2.75) N13(2.75,-2.75) N14(3.25,-2.75) P1(-3.25,-3.25) P2(-2.75,-3.25) P3(-2.25,-3.25) P4(-1.75,-3.25) P5(-1.25,-3.25) P6(-0.75,-3.25) P7(-0.25,-3.25) P8(0.25,-3.25) P9(0.75,-3.25) P10(1.25,-3.25) P11(1.75,-3.25) P12(2.25,-3.25) P13(2.75,-3.25) P14(3.25,-3.25)
FBGA-200_L15.0-W10.0-BL_RS512M32LO4D1BDS-53BT
  round 0.3 smd: A1(-6.825,-4.4) A2(-6.825,-3.6) A3(-6.825,-2.8) A4(-6.825,-2) A5(-6.825,-1.2) A8(-6.825,1.2) A9(-6.825,2) A10(-6.825,2.8) A11(-6.825,3.6) A12(-6.825,4.4) AA1(6.175,-4.4) AA2(6.175,-3.6) AA3(6.175,-2.8) AA4(6.175,-2) AA5(6.175,-1.2) AA8(6.175,1.2) AA9(6.175,2) AA10(6.175,2.8) AA11(6.175,3.6) AA12(6.175,4.4) AB1(6.825,-4.4) AB2(6.825,-3.6) AB3(6.825,-2.8) AB4(6.825,-2) AB5(6.825,-1.2) AB8(6.825,1.2) AB9(6.825,2) AB10(6.825,2.8) AB11(6.825,3.6) AB12(6.825,4.4) B1(-6.175,-4.4) B2(-6.175,-3.6) B3(-6.175,-2.8) B4(-6.175,-2) B5(-6.175,-1.2) B8(-6.175,1.2) B9(-6.175,2) B10(-6.175,2.8) B11(-6.175,3.6) B12(-6.175,4.4) C1(-5.525,-4.4) C2(-5.525,-3.6) C3(-5.525,-2.8) C4(-5.525,-2) C5(-5.525,-1.2) C8(-5.525,1.2) C9(-5.525,2) C10(-5.525,2.8) C11(-5.525,3.6) C12(-5.525,4.4) D1(-4.875,-4.4) D2(-4.875,-3.6) D3(-4.875,-2.8) D4(-4.875,-2) D5(-4.875,-1.2) D8(-4.875,1.2) D9(-4.875,2) D10(-4.875,2.8) D11(-4.875,3.6) D12(-4.875,4.4) E1(-4.225,-4.4) E2(-4.225,-3.6) E3(-4.225,-2.8) E4(-4.225,-2) E5(-4.225,-1.2) E8(-4.225,1.2) E9(-4.225,2) E10(-4.225,2.8) E11(-4.225,3.6) E12(-4.225,4.4) F1(-3.575,-4.4) F2(-3.575,-3.6) F3(-3.575,-2.8) F4(-3.575,-2) F5(-3.575,-1.2) F8(-3.575,1.2) F9(-3.575,2) F10(-3.575,2.8) F11(-3.575,3.6) F12(-3.575,4.4) G1(-2.925,-4.4) G2(-2.925,-3.6) G3(-2.925,-2.8) G4(-2.925,-2) G5(-2.925,-1.2) G8(-2.925,1.2) G9(-2.925,2) G10(-2.925,2.8) G11(-2.925,3.6) G12(-2.925,4.4) H1(-2.275,-4.4) H2(-2.275,-3.6) H3(-2.275,-2.8) H4(-2.275,-2) H5(-2.275,-1.2) H8(-2.275,1.2) H9(-2.275,2) H10(-2.275,2.8) H11(-2.275,3.6) H12(-2.275,4.4) J1(-1.625,-4.4) J2(-1.625,-3.6) J3(-1.625,-2.8) J4(-1.625,-2) J5(-1.625,-1.2) J8(-1.625,1.2) J9(-1.625,2) J10(-1.625,2.8) J11(-1.625,3.6) J12(-1.625,4.4) K1(-0.975,-4.4) K2(-0.975,-3.6) K3(-0.975,-2.8) K4(-0.975,-2) K5(-0.975,-1.2) K8(-0.975,1.2) K9(-0.975,2) K10(-0.975,2.8) K11(-0.975,3.6) K12(-0.975,4.4) N1(0.975,-4.4) N2(0.975,-3.6) N3(0.975,-2.8) N4(0.975,-2) N5(0.975,-1.2) N8(0.975,1.2) N9(0.975,2) N10(0.975,2.8) N11(0.975,3.6) N12(0.975,4.4) P1(1.625,-4.4) P2(1.625,-3.6) P3(1.625,-2.8) P4(1.625,-2) P5(1.625,-1.2) P8(1.625,1.2) P9(1.625,2) P10(1.625,2.8) P11(1.625,3.6) P12(1.625,4.4) R1(2.275,-4.4) R2(2.275,-3.6) R3(2.275,-2.8) R4(2.275,-2) R5(2.275,-1.2) R8(2.275,1.2) R9(2.275,2) R10(2.275,2.8) R11(2.275,3.6) R12(2.275,4.4) T1(2.925,-4.4) T2(2.925,-3.6) T3(2.925,-2.8) T4(2.925,-2) T5(2.925,-1.2) T8(2.925,1.2) T9(2.925,2) T10(2.925,2.8) T11(2.925,3.6) T12(2.925,4.4) U1(3.575,-4.4) U2(3.575,-3.6) U3(3.575,-2.8) U4(3.575,-2) U5(3.575,-1.2) U8(3.575,1.2) U9(3.575,2) U10(3.575,2.8) U11(3.575,3.6) U12(3.575,4.4) V1(4.225,-4.4) V2(4.225,-3.6) V3(4.225,-2.8) V4(4.225,-2) V5(4.225,-1.2) V8(4.225,1.2) V9(4.225,2) V10(4.225,2.8) V11(4.225,3.6) V12(4.225,4.4) W1(4.875,-4.4) W2(4.875,-3.6) W3(4.875,-2.8) W4(4.875,-2) W5(4.875,-1.2) W8(4.875,1.2) W9(4.875,2) W10(4.875,2.8) W11(4.875,3.6) W12(4.875,4.4) Y1(5.525,-4.4) Y2(5.525,-3.6) Y3(5.525,-2.8) Y4(5.525,-2) Y5(5.525,-1.2) Y8(5.525,1.2) Y9(5.525,2) Y10(5.525,2.8) Y11(5.525,3.6) Y12(5.525,4.4)
FCBGA-1088_L23.0-W23.0-P0.65-TL_RK3588
  round 0.3 smd: A1(-10.725,10.725) A2(-10.075,10.725) A3(-9.425,10.725) A4(-8.775,10.725) A5(-8.125,10.725) A6(-7.475,10.725) A7(-6.825,10.725) A8(-6.175,10.725) A9(-5.525,10.725) A10(-4.875,10.725) A11(-4.225,10.725) A12(-3.575,10.725) A13(-2.925,10.725) A14(-2.275,10.725) A15(-1.625,10.725) A16(-0.975,10.725) A17(-0.325,10.725) A18(0.325,10.725) A19(0.975,10.725) A20(1.625,10.725) A21(2.275,10.725) A22(2.925,10.725) A23(3.575,10.725) A24(4.225,10.725) A25(4.875,10.725) A26(5.525,10.725) A27(6.175,10.725) A28(6.825,10.725) A30(8.125,10.725) A32(9.425,10.725) A33(10.075,10.725) A34(10.725,10.725) AA1(-10.725,-2.275) AA2(-10.075,-2.275) AA3(-9.425,-2.275) AA4(-8.775,-2.275) AA5(-8.125,-2.275) AA6(-7.475,-2.275) AA7(-6.825,-2.275) AA8(-6.175,-2.275) AA9(-5.525,-2.275) AA10(-4.875,-2.275) AA11(-4.225,-2.275) AA12(-3.575,-2.275) AA13(-2.925,-2.275) AA14(-2.275,-2.275) AA15(-1.625,-2.275) AA16(-0.975,-2.275) AA17(-0.325,-2.275) AA18(0.325,-2.275) AA19(0.975,-2.275) AA20(1.625,-2.275) AA21(2.275,-2.275) AA22(2.925,-2.275) AA23(3.575,-2.275) AA24(4.225,-2.275) AA25(4.875,-2.275) AA26(5.525,-2.275) AA27(6.175,-2.275) AA28(6.825,-2.275) AA29(7.475,-2.275) AA30(8.125,-2.275) AA31(8.775,-2.275) AA32(9.425,-2.275) AA33(10.075,-2.275) AA34(10.725,-2.275) AB1(-10.725,-2.925) AB2(-10.075,-2.925) AB3(-9.425,-2.925) AB4(-8.775,-2.925) AB5(-8.125,-2.925) AB6(-7.475,-2.925) AB7(-6.825,-2.925) AB8(-6.175,-2.925) AB9(-5.525,-2.925) AB10(-4.875,-2.925) AB11(-4.225,-2.925) AB12(-3.575,-2.925) AB13(-2.925,-2.925) AB14(-2.275,-2.925) AB15(-1.625,-2.925) AB16(-0.975,-2.925) AB17(-0.325,-2.925) AB18(0.325,-2.925) AB19(0.975,-2.925) AB20(1.625,-2.925) AB21(2.275,-2.925) AB22(2.925,-2.925) AB23(3.575,-2.925) AB24(4.225,-2.925) AB25(4.875,-2.925) AB26(5.525,-2.925) AB27(6.175,-2.925) AB28(6.825,-2.925) AB29(7.475,-2.925) AB30(8.125,-2.925) AB31(8.775,-2.925) AB32(9.425,-2.925) AB33(10.075,-2.925) AB34(10.725,-2.925) AC1(-10.725,-3.575) AC2(-10.075,-3.575) AC3(-9.425,-3.575) AC4(-8.775,-3.575) AC5(-8.125,-3.575) AC6(-7.475,-3.575) AC7(-6.825,-3.575) AC8(-6.175,-3.575) AC9(-5.525,-3.575) AC10(-4.875,-3.575) AC11(-4.225,-3.575) AC12(-3.575,-3.575) AC13(-2.925,-3.575) AC14(-2.275,-3.575) AC15(-1.625,-3.575) AC16(-0.975,-3.575) AC17(-0.325,-3.575) AC18(0.325,-3.575) AC19(0.975,-3.575) AC20(1.625,-3.575) AC21(2.275,-3.575) AC22(2.925,-3.575) AC23(3.575,-3.575) AC24(4.225,-3.575) AC25(4.875,-3.575) AC26(5.525,-3.575) AC27(6.175,-3.575) AC28(6.825,-3.575) AC29(7.475,-3.575) AC30(8.125,-3.575) AC31(8.775,-3.575) AC32(9.425,-3.575) AC33(10.075,-3.575) AC34(10.725,-3.575) AD1(-10.725,-4.225) AD2(-10.075,-4.225) AD3(-9.425,-4.225) AD4(-8.775,-4.225) AD5(-8.125,-4.225) AD6(-7.475,-4.225) AD7(-6.825,-4.225) AD8(-6.175,-4.225) AD9(-5.525,-4.225) AD10(-4.875,-4.225) AD11(-4.225,-4.225) AD12(-3.575,-4.225) AD13(-2.925,-4.225) AD14(-2.275,-4.225) AD15(-1.625,-4.225) AD16(-0.975,-4.225) AD17(-0.325,-4.225) AD18(0.325,-4.225) AD19(0.975,-4.225) AD20(1.625,-4.225) AD21(2.275,-4.225) AD22(2.925,-4.225) AD23(3.575,-4.225) AD24(4.225,-4.225) AD25(4.875,-4.225) AD26(5.525,-4.225) AD27(6.175,-4.225) AD28(6.825,-4.225) AD29(7.475,-4.225) AD30(8.125,-4.225) AD31(8.775,-4.225) AD32(9.425,-4.225) AD33(10.075,-4.225) AD34(10.725,-4.225) AE1(-10.725,-4.875) AE2(-10.075,-4.875) AE3(-9.425,-4.875) AE4(-8.775,-4.875) AE5(-8.125,-4.875) AE6(-7.475,-4.875) AE7(-6.825,-4.875) AE8(-6.175,-4.875) AE9(-5.525,-4.875) AE11(-4.225,-4.875) AE12(-3.575,-4.875) AE13(-2.925,-4.875) AE14(-2.275,-4.875) AE15(-1.625,-4.875) AE16(-0.975,-4.875) AE18(0.325,-4.875) AE19(0.975,-4.875) AE20(1.625,-4.875) AE21(2.275,-4.875) AE22(2.925,-4.875) AE23(3.575,-4.875) AE24(4.225,-4.875) AE26(5.525,-4.875) AE27(6.175,-4.875) AE28(6.825,-4.875) AE29(7.475,-4.875) AE30(8.125,-4.875) AE31(8.775,-4.875) AE32(9.425,-4.875) AE33(10.075,-4.875) AE34(10.725,-4.875) AF1(-10.725,-5.525) AF2(-10.075,-5.525) AF3(-9.425,-5.525) AF4(-8.775,-5.525) AF5(-8.125,-5.525) AF6(-7.475,-5.525) AF7(-6.825,-5.525) AF8(-6.175,-5.525) AF11(-4.225,-5.525) AF12(-3.575,-5.525) AF13(-2.925,-5.525) AF14(-2.275,-5.525) AF15(-1.625,-5.525) AF16(-0.975,-5.525) AF18(0.325,-5.525) AF19(0.975,-5.525) AF20(1.625,-5.525) AF21(2.275,-5.525) AF22(2.925,-5.525) AF24(4.225,-5.525) AF25(4.875,-5.525) AF27(6.175,-5.525) AF28(6.825,-5.525) AF29(7.475,-5.525) AF30(8.125,-5.525) AF31(8.775,-5.525) AF32(9.425,-5.525) AF33(10.075,-5.525) AF34(10.725,-5.525) AG1(-10.725,-6.175) AG2(-10.075,-6.175) AG3(-9.425,-6.175) AG4(-8.775,-6.175) AG5(-8.125,-6.175) AG6(-7.475,-6.175) AG7(-6.825,-6.175) AG9(-5.525,-6.175) AG10(-4.875,-6.175) AG11(-4.225,-6.175) AG12(-3.575,-6.175) AG13(-2.925,-6.175) AG14(-2.275,-6.175) AG15(-1.625,-6.175) AG16(-0.975,-6.175) AG18(0.325,-6.175) AG19(0.975,-6.175) AG20(1.625,-6.175) AG21(2.275,-6.175) AG22(2.925,-6.175) AG23(3.575,-6.175) AG24(4.225,-6.175) AG25(4.875,-6.175) AG26(5.525,-6.175) AG28(6.825,-6.175) AG29(7.475,-6.175) AG30(8.125,-6.175) AG31(8.775,-6.175) AG32(9.425,-6.175) AG33(10.075,-6.175) AG34(10.725,-6.175) AH2(-10.075,-6.825) AH3(-9.425,-6.825) AH4(-8.775,-6.825) AH5(-8.125,-6.825) AH6(-7.475,-6.825) AH8(-6.175,-6.825) AH9(-5.525,-6.825) AH10(-4.875,-6.825) AH11(-4.225,-6.825) AH12(-3.575,-6.825) AH13(-2.925,-6.825) AH14(-2.275,-6.825) AH15(-1.625,-6.825) AH16(-0.975,-6.825) AH18(0.325,-6.825) AH19(0.975,-6.825) AH20(1.625,-6.825) AH21(2.275,-6.825) AH22(2.925,-6.825) AH23(3.575,-6.825) AH24(4.225,-6.825) AH25(4.875,-6.825) AH26(5.525,-6.825) AH27(6.175,-6.825) AH29(7.475,-6.825) AH30(8.125,-6.825) AH31(8.775,-6.825) AH32(9.425,-6.825) AH33(10.075,-6.825) AH34(10.725,-6.825) AJ1(-10.725,-7.475) AJ2(-10.075,-7.475) AJ3(-9.425,-7.475) AJ4(-8.775,-7.475) AJ5(-8.125,-7.475) AJ7(-6.825,-7.475) AJ8(-6.175,-7.475) AJ9(-5.525,-7.475) AJ10(-4.875,-7.475) AJ11(-4.225,-7.475) AJ12(-3.575,-7.475) AJ13(-2.925,-7.475) AJ14(-2.275,-7.475) AJ15(-1.625,-7.475) AJ16(-0.975,-7.475) AJ18(0.325,-7.475) AJ19(0.975,-7.475) AJ20(1.625,-7.475) AJ21(2.275,-7.475) AJ22(2.925,-7.475) AJ23(3.575,-7.475) AJ24(4.225,-7.475) AJ25(4.875,-7.475) AJ26(5.525,-7.475) AJ27(6.175,-7.475) AJ28(6.825,-7.475) AJ30(8.125,-7.475) AJ31(8.775,-7.475) AJ32(9.425,-7.475) AJ33(10.075,-7.475) AJ34(10.725,-7.475) AK2(-10.075,-8.125) AK3(-9.425,-8.125) AK4(-8.775,-8.125) AK5(-8.125,-8.125) AK6(-7.475,-8.125) AK7(-6.825,-8.125) AK8(-6.175,-8.125) AK9(-5.525,-8.125) AK10(-4.875,-8.125) AK11(-4.225,-8.125) AK12(-3.575,-8.125) AK13(-2.925,-8.125) AK14(-2.275,-8.125) AK15(-1.625,-8.125) AK16(-0.975,-8.125) AK17(-0.325,-8.125) AK18(0.325,-8.125) AK19(0.975,-8.125) AK20(1.625,-8.125) AK21(2.275,-8.125) AK22(2.925,-8.125) AK23(3.575,-8.125) AK24(4.225,-8.125) AK25(4.875,-8.125) AK26(5.525,-8.125) AK27(6.175,-8.125) AK28(6.825,-8.125) AK29(7.475,-8.125) AK30(8.125,-8.125) AK31(8.775,-8.125) AK32(9.425,-8.125) AK33(10.075,-8.125) AK34(10.725,-8.125) AL1(-10.725,-8.775) AL2(-10.075,-8.775) AL3(-9.425,-8.775) AL4(-8.775,-8.775) AL5(-8.125,-8.775) AL6(-7.475,-8.775) AL7(-6.825,-8.775) AL8(-6.175,-8.775) AL9(-5.525,-8.775) AL10(-4.875,-8.775) AL11(-4.225,-8.775) AL12(-3.575,-8.775) AL13(-2.925,-8.775) AL14(-2.275,-8.775) AL15(-1.625,-8.775) AL16(-0.975,-8.775) AL17(-0.325,-8.775) AL18(0.325,-8.775) AL19(0.975,-8.775) AL20(1.625,-8.775) AL21(2.275,-8.775) AL22(2.925,-8.775) AL23(3.575,-8.775) AL24(4.225,-8.775) AL25(4.875,-8.775) AL26(5.525,-8.775) AL27(6.175,-8.775) AL28(6.825,-8.775) AL29(7.475,-8.775) AL30(8.125,-8.775) AL31(8.775,-8.775) AL32(9.425,-8.775) AL33(10.075,-8.775) AL34(10.725,-8.775) AM2(-10.075,-9.425) AM3(-9.425,-9.425) AM4(-8.775,-9.425) AM5(-8.125,-9.425) AM7(-6.825,-9.425) AM8(-6.175,-9.425) AM9(-5.525,-9.425) AM10(-4.875,-9.425) AM12(-3.575,-9.425) AM14(-2.275,-9.425) AM15(-1.625,-9.425) AM16(-0.975,-9.425) AM17(-0.325,-9.425) AM18(0.325,-9.425) AM20(1.625,-9.425) AM22(2.925,-9.425) AM23(3.575,-9.425) AM24(4.225,-9.425) AM25(4.875,-9.425) AM26(5.525,-9.425) AM27(6.175,-9.425) AM28(6.825,-9.425) AM29(7.475,-9.425) AM30(8.125,-9.425) AM31(8.775,-9.425) AM32(9.425,-9.425) AM33(10.075,-9.425) AM34(10.725,-9.425) AN1(-10.725,-10.075) AN2(-10.075,-10.075) AN3(-9.425,-10.075) AN4(-8.775,-10.075) AN5(-8.125,-10.075) AN6(-7.475,-10.075) AN7(-6.825,-10.075) AN8(-6.175,-10.075) AN9(-5.525,-10.075) AN10(-4.875,-10.075) AN11(-4.225,-10.075) AN12(-3.575,-10.075) AN13(-2.925,-10.075) AN14(-2.275,-10.075) AN15(-1.625,-10.075) AN16(-0.975,-10.075) AN17(-0.325,-10.075) AN18(0.325,-10.075) AN19(0.975,-10.075) AN20(1.625,-10.075) AN21(2.275,-10.075) AN22(2.925,-10.075) AN23(3.575,-10.075) AN24(4.225,-10.075) AN25(4.875,-10.075) AN26(5.525,-10.075) AN27(6.175,-10.075) AN28(6.825,-10.075) AN29(7.475,-10.075) AN30(8.125,-10.075) AN31(8.775,-10.075) AN32(9.425,-10.075) AN33(10.075,-10.075) AN34(10.725,-10.075) AP1(-10.725,-10.725) AP2(-10.075,-10.725) AP4(-8.775,-10.725) AP6(-7.475,-10.725) AP7(-6.825,-10.725) AP8(-6.175,-10.725) AP9(-5.525,-10.725) AP10(-4.875,-10.725) AP11(-4.225,-10.725) AP12(-3.575,-10.725) AP13(-2.925,-10.725) AP14(-2.275,-10.725) AP15(-1.625,-10.725) AP16(-0.975,-10.725) AP17(-0.325,-10.725) AP18(0.325,-10.725) AP19(0.975,-10.725) AP20(1.625,-10.725) AP21(2.275,-10.725) AP22(2.925,-10.725) AP23(3.575,-10.725) AP24(4.225,-10.725) AP25(4.875,-10.725) AP26(5.525,-10.725) AP27(6.175,-10.725) AP28(6.825,-10.725) AP29(7.475,-10.725) AP30(8.125,-10.725) AP31(8.775,-10.725) AP32(9.425,-10.725) AP33(10.075,-10.725) AP34(10.725,-10.725) B1(-10.725,10.075) B2(-10.075,10.075) B3(-9.425,10.075) B4(-8.775,10.075) B5(-8.125,10.075) B6(-7.475,10.075) B7(-6.825,10.075) B8(-6.175,10.075) B9(-5.525,10.075) B10(-4.875,10.075) B11(-4.225,10.075) B12(-3.575,10.075) B13(-2.925,10.075) B14(-2.275,10.075) B15(-1.625,10.075) B16(-0.975,10.075) B17(-0.325,10.075) B18(0.325,10.075) B19(0.975,10.075) B20(1.625,10.075) B21(2.275,10.075) B22(2.925,10.075) B23(3.575,10.075) B24(4.225,10.075) B25(4.875,10.075) B26(5.525,10.075) B27(6.175,10.075) B28(6.825,10.075) B29(7.475,10.075) B30(8.125,10.075) B31(8.775,10.075) B32(9.425,10.075) B33(10.075,10.075) B34(10.725,10.075) C1(-10.725,9.425) C2(-10.075,9.425) C3(-9.425,9.425) C4(-8.775,9.425) C5(-8.125,9.425) C6(-7.475,9.425) C7(-6.825,9.425) C8(-6.175,9.425) C9(-5.525,9.425) C10(-4.875,9.425) C11(-4.225,9.425) C12(-3.575,9.425) C13(-2.925,9.425) C14(-2.275,9.425) C15(-1.625,9.425) C16(-0.975,9.425) C17(-0.325,9.425) C18(0.325,9.425) C19(0.975,9.425) C20(1.625,9.425) C21(2.275,9.425) C22(2.925,9.425) C23(3.575,9.425) C24(4.225,9.425) C25(4.875,9.425) C26(5.525,9.425) C27(6.175,9.425) C28(6.825,9.425) C29(7.475,9.425) C30(8.125,9.425) C31(8.775,9.425) C32(9.425,9.425) C33(10.075,9.425) C34(10.725,9.425) D1(-10.725,8.775) D2(-10.075,8.775) D3(-9.425,8.775) D4(-8.775,8.775) D5(-8.125,8.775) D7(-6.825,8.775) D9(-5.525,8.775) D10(-4.875,8.775) D11(-4.225,8.775) D13(-2.925,8.775) D14(-2.275,8.775) D16(-0.975,8.775) D17(-0.325,8.775) D19(0.975,8.775) D20(1.625,8.775) D21(2.275,8.775) D22(2.925,8.775) D23(3.575,8.775) D24(4.225,8.775) D25(4.875,8.775) D26(5.525,8.775) D27(6.175,8.775) D28(6.825,8.775) D29(7.475,8.775) D30(8.125,8.775) D31(8.775,8.775) D32(9.425,8.775) D33(10.075,8.775) E1(-10.725,8.125) E2(-10.075,8.125) E3(-9.425,8.125) E4(-8.775,8.125) E5(-8.125,8.125) E6(-7.475,8.125) E7(-6.825,8.125) E8(-6.175,8.125) E9(-5.525,8.125) E10(-4.875,8.125) E11(-4.225,8.125) E12(-3.575,8.125) E13(-2.925,8.125) E14(-2.275,8.125) E16(-0.975,8.125) E17(-0.325,8.125) E18(0.325,8.125) E19(0.975,8.125) E20(1.625,8.125) E21(2.275,8.125) E22(2.925,8.125) E23(3.575,8.125) E24(4.225,8.125) E25(4.875,8.125) E26(5.525,8.125) E27(6.175,8.125) E28(6.825,8.125) E29(7.475,8.125) E30(8.125,8.125) E31(8.775,8.125) E32(9.425,8.125) E33(10.075,8.125) E34(10.725,8.125) F1(-10.725,7.475) F2(-10.075,7.475) F3(-9.425,7.475) F4(-8.775,7.475) F5(-8.125,7.475) F7(-6.825,7.475) F8(-6.175,7.475) F9(-5.525,7.475) F10(-4.875,7.475) F11(-4.225,7.475) F12(-3.575,7.475) F13(-2.925,7.475) F14(-2.275,7.475) F15(-1.625,7.475) F16(-0.975,7.475) F18(0.325,7.475) F19(0.975,7.475) F20(1.625,7.475) F21(2.275,7.475) F22(2.925,7.475) F23(3.575,7.475) F24(4.225,7.475) F25(4.875,7.475) F26(5.525,7.475) F27(6.175,7.475) F28(6.825,7.475) F30(8.125,7.475) F31(8.775,7.475) F32(9.425,7.475) F33(10.075,7.475) G1(-10.725,6.825) G2(-10.075,6.825) G3(-9.425,6.825) G4(-8.775,6.825) G6(-7.475,6.825) G8(-6.175,6.825) G9(-5.525,6.825) G10(-4.875,6.825) G11(-4.225,6.825) G12(-3.575,6.825) G13(-2.925,6.825) G14(-2.275,6.825) G15(-1.625,6.825) G16(-0.975,6.825) G18(0.325,6.825) G19(0.975,6.825) G20(1.625,6.825) G21(2.275,6.825) G22(2.925,6.825) G23(3.575,6.825) G24(4.225,6.825) G25(4.875,6.825) G26(5.525,6.825) G27(6.175,6.825) G29(7.475,6.825) G30(8.125,6.825) G31(8.775,6.825) G32(9.425,6.825) G33(10.075,6.825) G34(10.725,6.825) H1(-10.725,6.175) H2(-10.075,6.175) H3(-9.425,6.175) H4(-8.775,6.175) H5(-8.125,6.175) H6(-7.475,6.175) H7(-6.825,6.175) H9(-5.525,6.175) H10(-4.875,6.175) H11(-4.225,6.175) H12(-3.575,6.175) H13(-2.925,6.175) H14(-2.275,6.175) H15(-1.625,6.175) H16(-0.975,6.175) H18(0.325,6.175) H19(0.975,6.175) H20(1.625,6.175) H21(2.275,6.175) H22(2.925,6.175) H23(3.575,6.175) H24(4.225,6.175) H25(4.875,6.175) H26(5.525,6.175) H28(6.825,6.175) H29(7.475,6.175) H30(8.125,6.175) H31(8.775,6.175) H32(9.425,6.175) H33(10.075,6.175) J1(-10.725,5.525) J2(-10.075,5.525) J3(-9.425,5.525) J4(-8.775,5.525) J5(-8.125,5.525) J6(-7.475,5.525) J7(-6.825,5.525) J8(-6.175,5.525) J10(-4.875,5.525) J11(-4.225,5.525) J12(-3.575,5.525) J13(-2.925,5.525) J14(-2.275,5.525) J15(-1.625,5.525) J16(-0.975,5.525) J18(0.325,5.525) J19(0.975,5.525) J20(1.625,5.525) J21(2.275,5.525) J22(2.925,5.525) J23(3.575,5.525) J24(4.225,5.525) J25(4.875,5.525) J27(6.175,5.525) J28(6.825,5.525) J29(7.475,5.525) J30(8.125,5.525) J31(8.775,5.525) J32(9.425,5.525) J33(10.075,5.525) J34(10.725,5.525) K1(-10.725,4.875) K2(-10.075,4.875) K3(-9.425,4.875) K4(-8.775,4.875) K5(-8.125,4.875) K6(-7.475,4.875) K7(-6.825,4.875) K8(-6.175,4.875) K9(-5.525,4.875) K11(-4.225,4.875) K12(-3.575,4.875) K13(-2.925,4.875) K14(-2.275,4.875) K15(-1.625,4.875) K16(-0.975,4.875) K18(0.325,4.875) K19(0.975,4.875) K20(1.625,4.875) K21(2.275,4.875) K22(2.925,4.875) K23(3.575,4.875) K24(4.225,4.875) K26(5.525,4.875) K27(6.175,4.875) K28(6.825,4.875) K29(7.475,4.875) K30(8.125,4.875) K31(8.775,4.875) K32(9.425,4.875) K33(10.075,4.875) K34(10.725,4.875) L1(-10.725,4.225) L2(-10.075,4.225) L3(-9.425,4.225) L4(-8.775,4.225) L5(-8.125,4.225) L6(-7.475,4.225) L7(-6.825,4.225) L8(-6.175,4.225) L9(-5.525,4.225) L10(-4.875,4.225) L11(-4.225,4.225) L12(-3.575,4.225) L13(-2.925,4.225) L14(-2.275,4.225) L15(-1.625,4.225) L16(-0.975,4.225) L17(-0.325,4.225) L18(0.325,4.225) L19(0.975,4.225) L20(1.625,4.225) L21(2.275,4.225) L22(2.925,4.225) L23(3.575,4.225) L24(4.225,4.225) L25(4.875,4.225) L26(5.525,4.225) L27(6.175,4.225) L28(6.825,4.225) L29(7.475,4.225) L30(8.125,4.225) L31(8.775,4.225) L32(9.425,4.225) L33(10.075,4.225) M1(-10.725,3.575) M2(-10.075,3.575) M3(-9.425,3.575) M5(-8.125,3.575) M6(-7.475,3.575) M7(-6.825,3.575) M8(-6.175,3.575) M9(-5.525,3.575) M10(-4.875,3.575) M11(-4.225,3.575) M12(-3.575,3.575) M13(-2.925,3.575) M14(-2.275,3.575) M15(-1.625,3.575) M16(-0.975,3.575) M17(-0.325,3.575) M18(0.325,3.575) M19(0.975,3.575) M20(1.625,3.575) M21(2.275,3.575) M22(2.925,3.575) M23(3.575,3.575) M24(4.225,3.575) M25(4.875,3.575) M26(5.525,3.575) M27(6.175,3.575) M28(6.825,3.575) M29(7.475,3.575) M30(8.125,3.575) M31(8.775,3.575) M32(9.425,3.575) M33(10.075,3.575) M34(10.725,3.575) N1(-10.725,2.925) N2(-10.075,2.925) N3(-9.425,2.925) N4(-8.775,2.925) N5(-8.125,2.925) N6(-7.475,2.925) N7(-6.825,2.925) N8(-6.175,2.925) N9(-5.525,2.925) N10(-4.875,2.925) N11(-4.225,2.925) N12(-3.575,2.925) N13(-2.925,2.925) N14(-2.275,2.925) N15(-1.625,2.925) N16(-0.975,2.925) N17(-0.325,2.925) N18(0.325,2.925) N19(0.975,2.925) N20(1.625,2.925) N21(2.275,2.925) N22(2.925,2.925) N23(3.575,2.925) N24(4.225,2.925) N25(4.875,2.925) N26(5.525,2.925) N27(6.175,2.925) N28(6.825,2.925) N29(7.475,2.925) N30(8.125,2.925) N31(8.775,2.925) N32(9.425,2.925) N33(10.075,2.925) N34(10.725,2.925) P1(-10.725,2.275) P2(-10.075,2.275) P3(-9.425,2.275) P4(-8.775,2.275) P5(-8.125,2.275) P6(-7.475,2.275) P7(-6.825,2.275) P8(-6.175,2.275) P9(-5.525,2.275) P10(-4.875,2.275) P11(-4.225,2.275) P12(-3.575,2.275) P13(-2.925,2.275) P14(-2.275,2.275) P15(-1.625,2.275) P16(-0.975,2.275) P17(-0.325,2.275) P18(0.325,2.275) P19(0.975,2.275) P20(1.625,2.275) P21(2.275,2.275) P22(2.925,2.275) P23(3.575,2.275) P24(4.225,2.275) P25(4.875,2.275) P26(5.525,2.275) P27(6.175,2.275) P28(6.825,2.275) P29(7.475,2.275) P30(8.125,2.275) P31(8.775,2.275) P32(9.425,2.275) P33(10.075,2.275) P34(10.725,2.275) R1(-10.725,1.625) R2(-10.075,1.625) R3(-9.425,1.625) R5(-8.125,1.625) R6(-7.475,1.625) R7(-6.825,1.625) R8(-6.175,1.625) R9(-5.525,1.625) R10(-4.875,1.625) R11(-4.225,1.625) R12(-3.575,1.625) R13(-2.925,1.625) R14(-2.275,1.625) R15(-1.625,1.625) R16(-0.975,1.625) R17(-0.325,1.625) R18(0.325,1.625) R19(0.975,1.625) R20(1.625,1.625) R21(2.275,1.625) R22(2.925,1.625) R23(3.575,1.625) R24(4.225,1.625) R25(4.875,1.625) R26(5.525,1.625) R27(6.175,1.625) R28(6.825,1.625) R29(7.475,1.625) R30(8.125,1.625) R31(8.775,1.625) R32(9.425,1.625) R33(10.075,1.625) R34(10.725,1.625) T1(-10.725,0.975) T2(-10.075,0.975) T3(-9.425,0.975) T4(-8.775,0.975) T5(-8.125,0.975) T6(-7.475,0.975) T7(-6.825,0.975) T8(-6.175,0.975) T9(-5.525,0.975) T10(-4.875,0.975) T11(-4.225,0.975) T12(-3.575,0.975) T13(-2.925,0.975) T14(-2.275,0.975) T15(-1.625,0.975) T16(-0.975,0.975) T17(-0.325,0.975) T18(0.325,0.975) T19(0.975,0.975) T20(1.625,0.975) T21(2.275,0.975) T22(2.925,0.975) T23(3.575,0.975) T24(4.225,0.975) T25(4.875,0.975) T26(5.525,0.975) T27(6.175,0.975) T28(6.825,0.975) T29(7.475,0.975) T30(8.125,0.975) T31(8.775,0.975) T32(9.425,0.975) T33(10.075,0.975) T34(10.725,0.975) U1(-10.725,0.325) U2(-10.075,0.325) U3(-9.425,0.325) U4(-8.775,0.325) U5(-8.125,0.325) U11(-4.225,0.325) U12(-3.575,0.325) U13(-2.925,0.325) U14(-2.275,0.325) U15(-1.625,0.325) U16(-0.975,0.325) U17(-0.325,0.325) U18(0.325,0.325) U19(0.975,0.325) U20(1.625,0.325) U21(2.275,0.325) U22(2.925,0.325) U23(3.575,0.325) U24(4.225,0.325) U30(8.125,0.325) U31(8.775,0.325) U32(9.425,0.325) U33(10.075,0.325) U34(10.725,0.325) V1(-10.725,-0.325) V2(-10.075,-0.325) V3(-9.425,-0.325) V4(-8.775,-0.325) V5(-8.125,-0.325) V6(-7.475,-0.325) V7(-6.825,-0.325) V8(-6.175,-0.325) V9(-5.525,-0.325) V10(-4.875,-0.325) V11(-4.225,-0.325) V12(-3.575,-0.325) V13(-2.925,-0.325) V14(-2.275,-0.325) V15(-1.625,-0.325) V16(-0.975,-0.325) V17(-0.325,-0.325) V18(0.325,-0.325) V19(0.975,-0.325) V20(1.625,-0.325) V21(2.275,-0.325) V22(2.925,-0.325) V23(3.575,-0.325) V24(4.225,-0.325) V25(4.875,-0.325) V26(5.525,-0.325) V27(6.175,-0.325) V28(6.825,-0.325) V29(7.475,-0.325) V30(8.125,-0.325) V31(8.775,-0.325) V32(9.425,-0.325) V33(10.075,-0.325) V34(10.725,-0.325) W1(-10.725,-0.975) W2(-10.075,-0.975) W3(-9.425,-0.975) W4(-8.775,-0.975) W5(-8.125,-0.975) W6(-7.475,-0.975) W7(-6.825,-0.975) W8(-6.175,-0.975) W9(-5.525,-0.975) W10(-4.875,-0.975) W11(-4.225,-0.975) W12(-3.575,-0.975) W13(-2.925,-0.975) W14(-2.275,-0.975) W15(-1.625,-0.975) W16(-0.975,-0.975) W17(-0.325,-0.975) W18(0.325,-0.975) W19(0.975,-0.975) W20(1.625,-0.975) W21(2.275,-0.975) W22(2.925,-0.975) W23(3.575,-0.975) W24(4.225,-0.975) W25(4.875,-0.975) W26(5.525,-0.975) W27(6.175,-0.975) W28(6.825,-0.975) W29(7.475,-0.975) W30(8.125,-0.975) W31(8.775,-0.975) W32(9.425,-0.975) W33(10.075,-0.975) W34(10.725,-0.975) Y1(-10.725,-1.625) Y2(-10.075,-1.625) Y3(-9.425,-1.625) Y4(-8.775,-1.625) Y5(-8.125,-1.625) Y6(-7.475,-1.625) Y7(-6.825,-1.625) Y8(-6.175,-1.625) Y9(-5.525,-1.625) Y10(-4.875,-1.625) Y11(-4.225,-1.625) Y12(-3.575,-1.625) Y13(-2.925,-1.625) Y14(-2.275,-1.625) Y15(-1.625,-1.625) Y16(-0.975,-1.625) Y17(-0.325,-1.625) Y18(0.325,-1.625) Y19(0.975,-1.625) Y20(1.625,-1.625) Y21(2.275,-1.625) Y22(2.925,-1.625) Y23(3.575,-1.625) Y24(4.225,-1.625) Y26(5.525,-1.625) Y27(6.175,-1.625) Y28(6.825,-1.625) Y29(7.475,-1.625) Y30(8.125,-1.625) Y31(8.775,-1.625) Y32(9.425,-1.625) Y33(10.075,-1.625) Y34(10.725,-1.625)
